# Altium schematic sheet P1.schdoc
size 420 x 297 mm; Symbol: Drawing-Symbol_A3; @Create Time: 23:14:21; @Update Time: 22:26:34; Border: 1; Width: 1655; Height: 1170; Region Start: 1; X Region Count: 6; Y Region Count: 4; Blade Width: 10; Title Block Position: 3; @Board Name: Board1; Drawed: YongjianZhu; Version: V2.0; Page Size: A3; @Project Name: AWUG20250915_backup; @Page Count: 1; @Update Date: 2025-09-18; @Create Date: 2025-09-17; @Schematic Name: Schematic1; @Page No: 1; @Page Name: P1; Device: Drawing-Symbol_A3
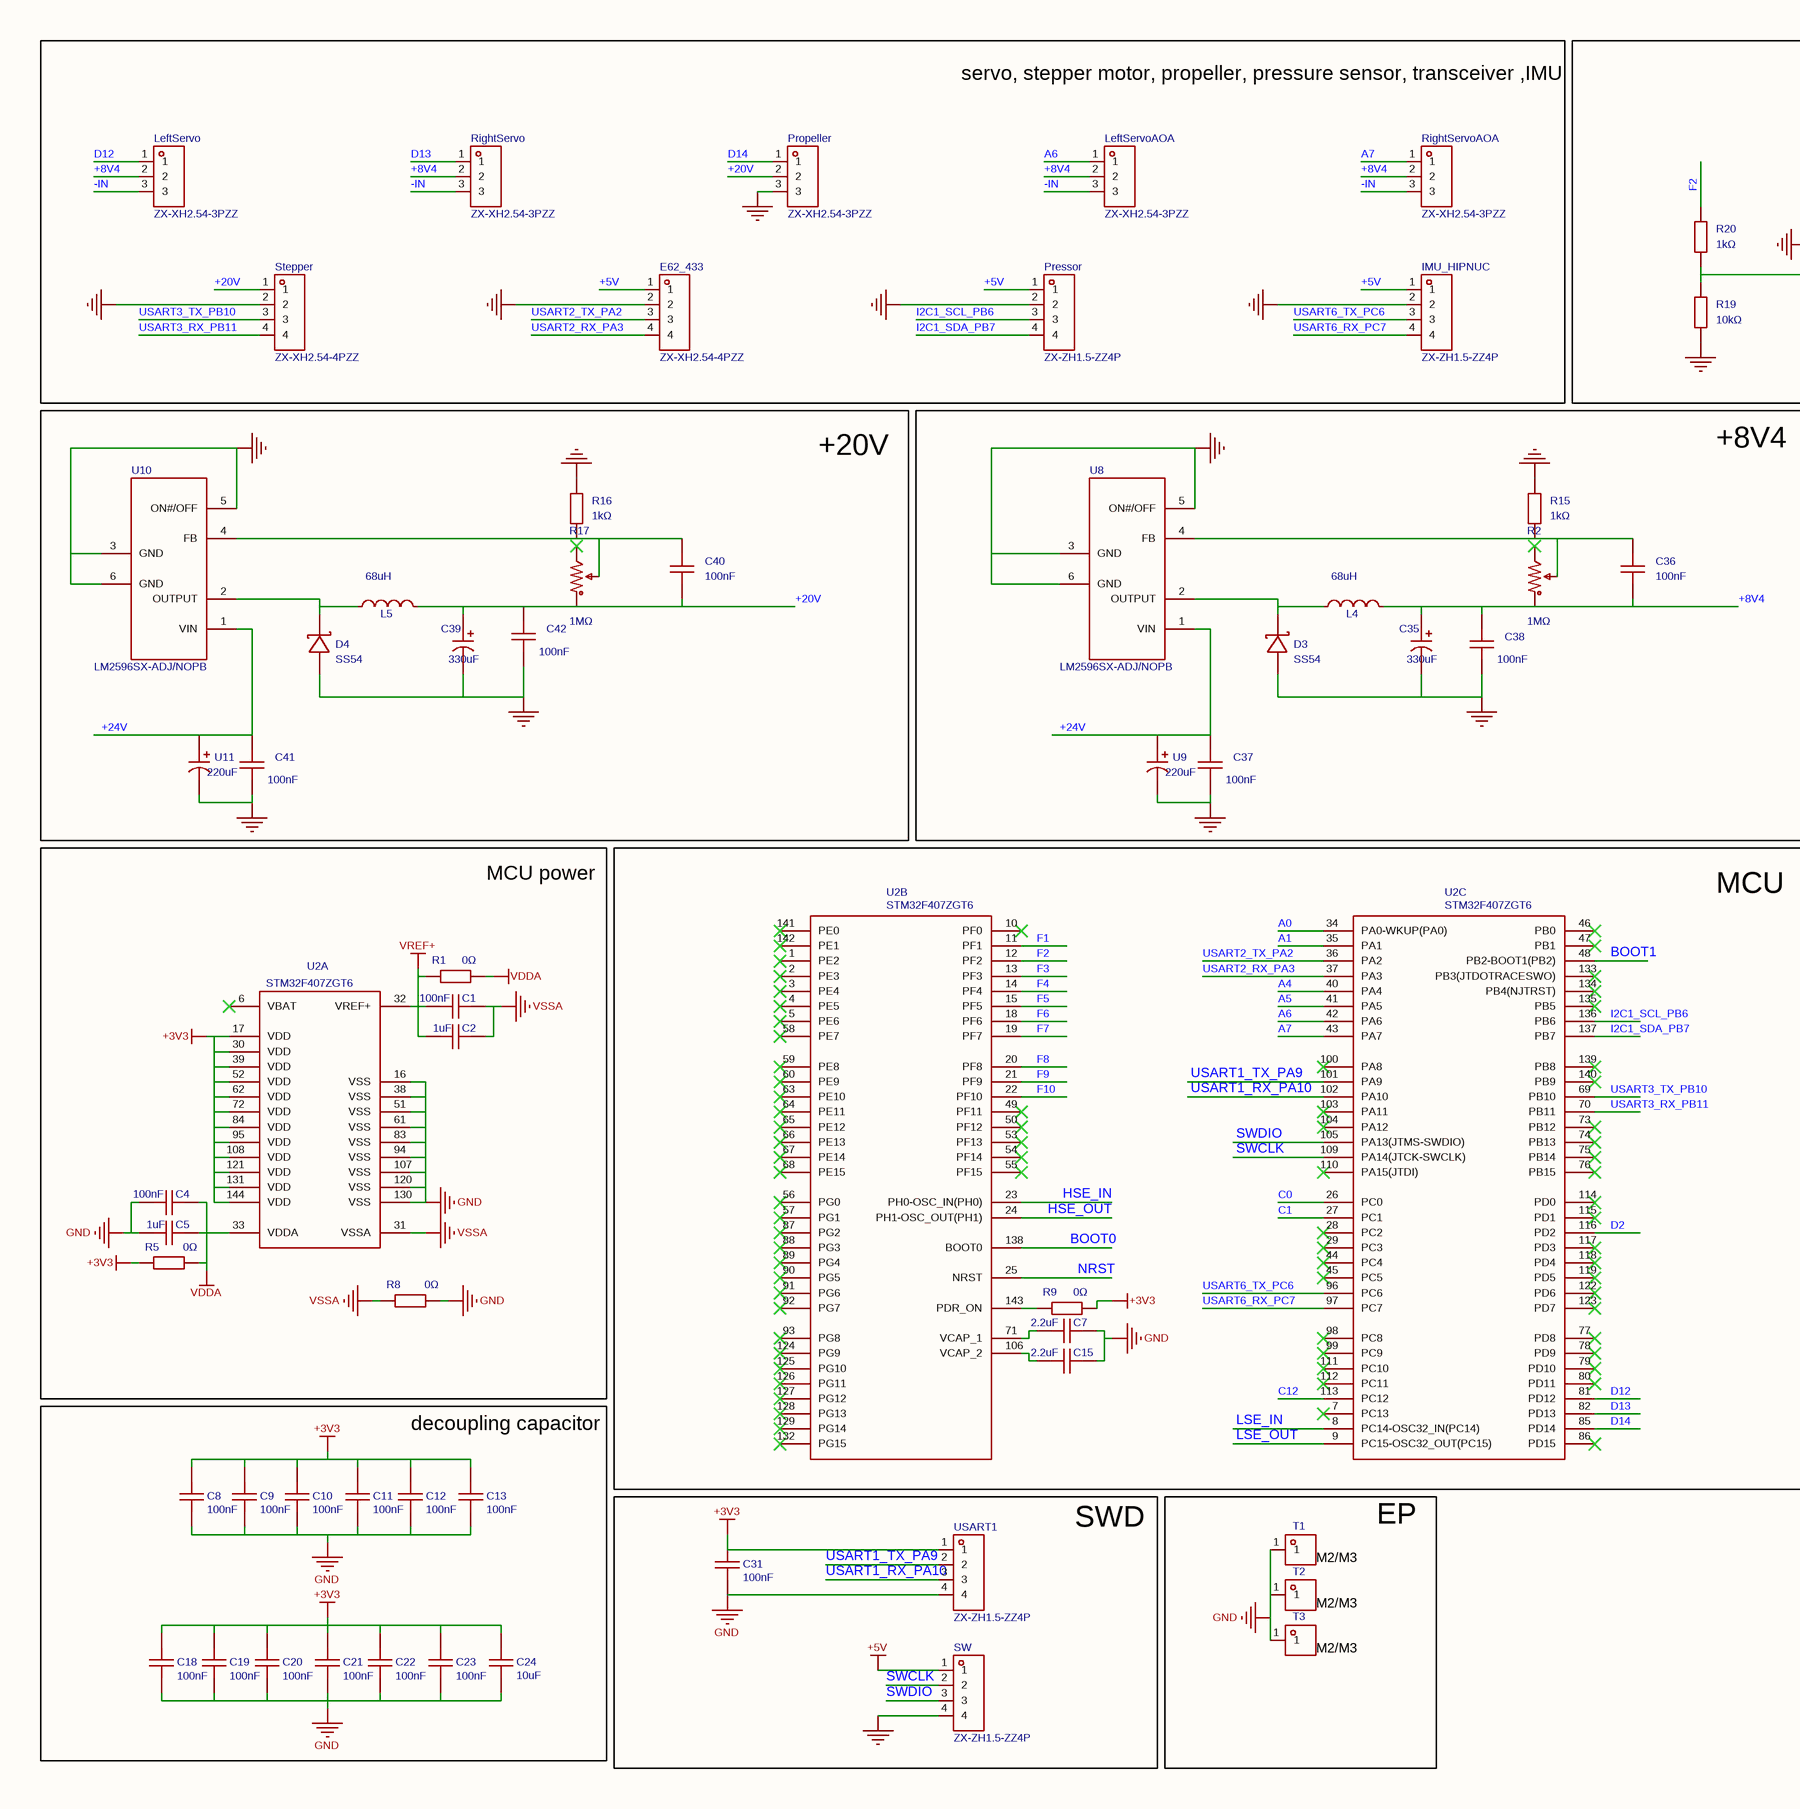
[diagram p0: P1.schdoc, left]
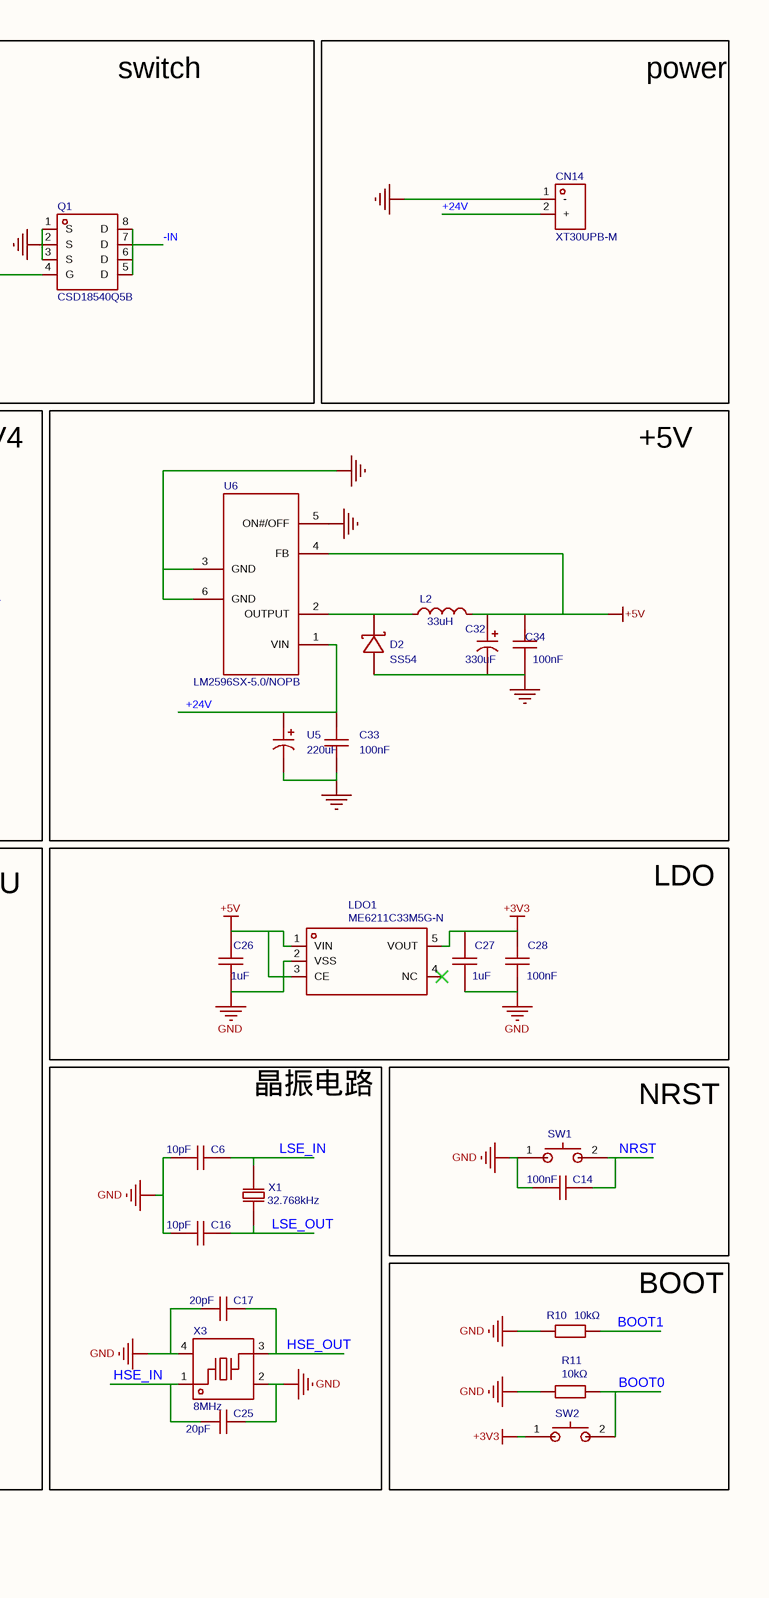
[diagram p1: P1.schdoc, right]

## Parts
C1  100nF  [C0603]
C2  1uF  [C0603]
C4  100nF  [C0603]
C5  1uF  [C0603]
C6  10pF  [C0603]
C7  2.2uF  [C0603]
C8  100nF  [C0603]
C9  100nF  [C0603]
C10  100nF  [C0603]
C11  100nF  [C0603]
C12  100nF  [C0603]
C13  100nF  [C0603]
C14  100nF  [C0603]
C15  2.2uF  [C0603]
C16  10pF  [C0603]
C17  20pF  [C0603]
C18  100nF  [C0603]
C19  100nF  [C0603]
C20  100nF  [C0603]
C21  100nF  [C0603]
C22  100nF  [C0603]
C23  100nF  [C0603]
C24  10uF  [C0603]
C25  20pF  [C0603]
C26  1uF  [C0603]
C27  1uF  [C0603]
C28  100nF  [C0603]
C31  100nF  [C0603]
C32  330uF  [CAP-SMD_BD10.0-L10.3-W10.3-LS10.8-FD]
C33  100nF  [C0805]
C34  100nF  [C0805]
C35  330uF  [CAP-SMD_BD10.0-L10.3-W10.3-LS10.8-FD]
C36  100nF  [C0805]
C37  100nF  [C0805]
C38  100nF  [C0805]
C39  330uF  [CAP-SMD_BD10.0-L10.3-W10.3-LS10.8-FD]
C40  100nF  [C0805]
C41  100nF  [C0805]
C42  100nF  [C0805]
CN14  XT30UPB-M  [CONN-TH_XT30UPB-M]
D2  SS54  [SMA_L4.4-W2.8-LS5.4-R-RD]
D3  SS54  [SMA_L4.4-W2.8-LS5.4-R-RD]
D4  SS54  [SMA_L4.4-W2.8-LS5.4-R-RD]
E62_433  ZX-XH2.54-4PZZ  [CONN-TH_4P-P2.50_4PIN]
IMU_HIPNUC  ZX-ZH1.5-ZZ4P  [CONN-TH_4P-P1.50_ZX-ZH1.5-ZZ4P]
L2  33uH  [IND-SMD_L11.6-W10.1]
L4  68uH  [IND-SMD_L13.5-W12.6_XR_XR1265]
L5  68uH  [IND-SMD_L13.5-W12.6_XR_XR1265]
LDO1  ME6211C33M5G-N  [SOT-23-5_L3.0-W1.7-P0.95-LS2.8-BL]
LeftServo  ZX-XH2.54-3PZZ  [CONN-TH_3P-P2.54_2501S-3P]
LeftServoAOA  ZX-XH2.54-3PZZ  [CONN-TH_3P-P2.54_2501S-3P]
Pressor  ZX-ZH1.5-ZZ4P  [CONN-TH_4P-P1.50_ZX-ZH1.5-ZZ4P]
Propeller  ZX-XH2.54-3PZZ  [CONN-TH_3P-P2.54_2501S-3P]
Q1  CSD18540Q5B  [VSON-CLIP-8_L5.0-W6.0-P1.27-BL]
R1  0Ω  [R0603]
R2  1MΩ  [RES-ADJ-TH_3P-L10.0-W10.0-P2.50-BL-BS]
R5  0Ω  [R0603]
R8  0Ω  [R0603]
R9  0Ω  [R0603]
R10  10kΩ  [R0603]
R11  10kΩ  [R0603]
R15  1kΩ  [R0805]
R16  1kΩ  [R0805]
R17  1MΩ  [RES-ADJ-TH_3P-L10.0-W10.0-P2.50-BL-BS]
R19  10kΩ  [R0603]
R20  1kΩ  [R0805]
RightServo  ZX-XH2.54-3PZZ  [CONN-TH_3P-P2.54_2501S-3P]
RightServoAOA  ZX-XH2.54-3PZZ  [CONN-TH_3P-P2.54_2501S-3P]
Stepper  ZX-XH2.54-4PZZ  [CONN-TH_4P-P2.50_4PIN]
SW  ZX-ZH1.5-ZZ4P  [CONN-TH_4P-P1.50_ZX-ZH1.5-ZZ4P]
SW1  GT-TC029B-H020-L1N  [SW-SMD_L3.9-W2.9-P4.15-LS5.0]  (value not drawn)
SW2  GT-TC029B-H020-L1N  [SW-SMD_L3.9-W2.9-P4.15-LS5.0]  (value not drawn)
T1  M2_M3  [M3X16+6_L]  (value not drawn)
T2  M2_M3  [M3X16+6_L]  (value not drawn)
T3  M2_M3  [M3X16+6_L]  (value not drawn)
U2  STM32F407ZGT6  [LQFP-144_L20.0-W20.0-P0.50-LS22.0-BL]  (parts A,B,C of 3)
U5  220uF  [CAP-SMD_BD10.0-L10.3-W10.3-FD]
U6  LM2596SX-5.0/NOPB  [TO-263-5_L10.2-W8.9-P1.70-TL]
U8  LM2596SX-ADJ/NOPB  [TO-263-5_L10.2-W8.9-P1.70-TL]
U9  220uF  [CAP-SMD_BD10.0-L10.3-W10.3-FD]
U10  LM2596SX-ADJ/NOPB  [TO-263-5_L10.2-W8.9-P1.70-TL]
U11  220uF  [CAP-SMD_BD10.0-L10.3-W10.3-FD]
USART1  ZX-ZH1.5-ZZ4P  [CONN-TH_4P-P1.50_ZX-ZH1.5-ZZ4P]
X1  32.768kHz  [FC-135R_L3.2-W1.5]
X3  8MHz  [CRYSTAL-SMD_4P-L3.2-W2.5-BL]

## Blocks framed on the sheet
switch: Q1 R19 R20
power: CN14
+20V: C39-C42 D4 L5 R16 R17 U10 U11
+8V4: C35-C38 D3 L4 R2 R15 U8 U9
+5V: C32-C34 D2 L2 U5 U6
MCU power: C1 C2 C4 C5 R1 R5 R8 U2
MCU: C7 C15 R9 U2
LDO: C26-C28 LDO1
晶振电路: C6 C16 C17 C25 X1 X3
NRST: C14 SW1
BOOT: R10 R11 SW2
decoupling capacitor: C8-C13 C18-C24
SWD: C31 SW USART1
EP: T1-T3

## Nets
+3V3: C8.2 C9.2 C10.2 C11.2 C12.2 C13.2 C18.2 C19.2 C20.2 C21.2 C22.2 C23.2 C24.2 C27.2 C28.2 C31.2 LDO1.5(VOUT) R5.2 R9.2 SW2.1 U2.17(VDD) U2.30(VDD) U2.39(VDD) U2.52(VDD) U2.62(VDD) U2.72(VDD) U2.84(VDD) U2.95(VDD) U2.108(VDD) U2.121(VDD) U2.131(VDD) U2.144(VDD) USART1.1
+5V: C26.2 C32.1 C34.2 E62_433.1 IMU_HIPNUC.1 L2.2 LDO1.1(VIN) LDO1.3(CE) Pressor.1 SW.1 U6.4(FB)
GND: C4.2 C5.2 C6.2 C7.2 C8.1 C9.1 C10.1 C11.1 C12.1 C13.1 C14.2 C15.2 C16.2 C17.1 C18.1 C19.1 C20.1 C21.1 C22.1 C23.1 C24.1 C25.2 C26.1 C27.1 C28.1 C31.1 C32.2 C33.1 C34.1 C35.2 C37.1 C38.1 C39.2 C41.1 C42.1 CN14.1(-) D2.1(A) D3.1(A) D4.1(A) E62_433.2 IMU_HIPNUC.2 LDO1.2(VSS) Pressor.2 Propeller.3 Q1.1(S) Q1.2(S) Q1.3(S) R8.1 R10.1 R11.1 R15.2 R16.2 R19.1 Stepper.2 SW.4 SW1.1 T1.1 T2.1 T3.1 U2.16(VSS) U2.38(VSS) U2.51(VSS) U2.61(VSS) U2.83(VSS) U2.94(VSS) U2.107(VSS) U2.120(VSS) U2.130(VSS) U5.2 U6.3(GND) U6.5(ON#/OFF) U6.6(GND) U8.3(GND) U8.5(ON#/OFF) U8.6(GND) U9.2 U10.3(GND) U10.5(ON#/OFF) U10.6(GND) U11.2 USART1.4 X3.2(GND) X3.4(GND)
VDDA: C4.1 C5.1 R1.2 R5.1 U2.33(VDDA)
VREF+: C1.2 C2.2 R1.1 U2.32(VREF+)
VSSA: C1.1 C2.1 R8.2 U2.31(VSSA)
+8V4: C35.1 C36.1 C38.2 L4.2 LeftServo.2 LeftServoAOA.2 R2.1 RightServo.2 RightServoAOA.2
+20V: C39.1 C40.1 C42.2 L5.2 Propeller.2 R17.1 Stepper.1
+24V: C33.2 C37.2 C41.2 CN14.2(+) U5.1 U6.1(VIN) U8.1(VIN) U9.1 U10.1(VIN) U11.1
-IN: LeftServo.3 LeftServoAOA.3 Q1.5(D) Q1.6(D) Q1.7(D) Q1.8(D) RightServo.3 RightServoAOA.3
A0: U2.34(PA0-WKUP(PA0))
A1: U2.35(PA1)
A4: U2.40(PA4)
A5: U2.41(PA5)
A6: LeftServoAOA.1 U2.42(PA6)
A7: RightServoAOA.1 U2.43(PA7)
BOOT0: R11.2 SW2.2 U2.138(BOOT0)
BOOT1: R10.2 U2.48(PB2-BOOT1(PB2))
C0: U2.26(PC0)
C1: U2.27(PC1)
C12: U2.113(PC12)
D2: U2.116(PD2)
D12: LeftServo.1 U2.81(PD12)
D13: RightServo.1 U2.82(PD13)
D14: Propeller.1 U2.85(PD14)
F1: U2.11(PF1)
F2: R20.2 U2.12(PF2)
F3: U2.13(PF3)
F4: U2.14(PF4)
F5: U2.15(PF5)
F6: U2.18(PF6)
F7: U2.19(PF7)
F8: U2.20(PF8)
F9: U2.21(PF9)
F10: U2.22(PF10)
HSE_IN: C25.1 U2.23(PH0-OSC_IN(PH0)) X3.1
HSE_OUT: C17.2 U2.24(PH1-OSC_OUT(PH1)) X3.3
I2C1_SCL_PB6: Pressor.3 U2.136(PB6)
I2C1_SDA_PB7: Pressor.4 U2.137(PB7)
LSE_IN: C6.1 U2.8(PC14-OSC32_IN(PC14)) X1.1
LSE_OUT: C16.1 U2.9(PC15-OSC32_OUT(PC15)) X1.2
NRST: C14.1 SW1.2 U2.25(NRST)
SWCLK: SW.2 U2.109(PA14(JTCK-SWCLK))
SWDIO: SW.3 U2.105(PA13(JTMS-SWDIO))
USART1_RX_PA10: U2.102(PA10) USART1.3
USART1_TX_PA9: U2.101(PA9) USART1.2
USART2_RX_PA3: E62_433.4 U2.37(PA3)
USART2_TX_PA2: E62_433.3 U2.36(PA2)
USART3_RX_PB11: Stepper.4 U2.70(PB11)
USART3_TX_PB10: Stepper.3 U2.69(PB10)
USART6_RX_PC7: IMU_HIPNUC.4 U2.97(PC7)
USART6_TX_PC6: IMU_HIPNUC.3 U2.96(PC6)
NetC7_1: C7.1 U2.71(VCAP_1)
NetC15_1: C15.1 U2.106(VCAP_2)
NetC36_2: C36.2 R2.2 R15.1 U8.4(FB)
NetC40_2: C40.2 R16.1 R17.2 U10.4(FB)
NetD2_2: D2.2(K) L2.1 U6.2(OUTPUT)
NetD3_2: D3.2(K) L4.1 U8.2(OUTPUT)
NetD4_2: D4.2(K) L5.1 U10.2(OUTPUT)
NetQ1_4: Q1.4(G) R19.2 R20.1
NetR9_1: R9.1 U2.143(PDR_ON)

Not connected (* = marked no-connect by the designer): LDO1 4(NC)*; R2 3*; R17 3*; U2 1(PE2)* 2(PE3)* 3(PE4)* 4(PE5)* 5(PE6)* 6(VBAT)* 7(PC13)* 10(PF0)* 28(PC2)* 29(PC3)* 44(PC4)* 45(PC5)* 46(PB0)* 47(PB1)* 49(PF11)* 50(PF12)* 53(PF13)* 54(PF14)* 55(PF15)* 56(PG0)* 57(PG1)* 58(PE7)* 59(PE8)* 60(PE9)* 63(PE10)* 64(PE11)* 65(PE12)* 66(PE13)* 67(PE14)* 68(PE15)* 73(PB12)* 74(PB13)* 75(PB14)* 76(PB15)* 77(PD8)* 78(PD9)* 79(PD10)* 80(PD11)* 86(PD15)* 87(PG2)* 88(PG3)* 89(PG4)* 90(PG5)* 91(PG6)* 92(PG7)* 93(PG8)* 98(PC8)* 99(PC9)* 100(PA8)* 103(PA11)* 104(PA12)* 110(PA15(JTDI))* 111(PC10)* 112(PC11)* 114(PD0)* 115(PD1)* 117(PD3)* 118(PD4)* 119(PD5)* 122(PD6)* 123(PD7)* 124(PG9)* 125(PG10)* 126(PG11)* 127(PG12)* 128(PG13)* 129(PG14)* 132(PG15)* 133(PB3(JTDOTRACESWO))* 134(PB4(NJTRST))* 135(PB5)* 139(PB8)* 140(PB9)* 141(PE0)* 142(PE1)*

## Notes on the sheet
- servo, stepper motor, propeller, pressure sensor, transceiver ,IMU
- 创建日期
- 2025-09-17
- 原理图
- 板子
- Schematic1
- Board1
- 更新日期
- 图页
- 2025-09-18
- P1
- 绘制
- 审阅
- YongjianZhu
- AWUG20250915_backup
- 版本
- V2.0
- 尺寸
- A3
- 页    1    共    1
- (in symbol M2_M3) M2/M3

## Library data of the parts
C1 C4 C8-C14 C18-C23 C28 C31 = CL10B104KB8NNNC: 容值:100nF;精度:±10%;额定电压:50V;材质(温度系数):X7R;; Manufacturer: SAMSUNG(三星); Symbol: 0.1u; AddInBom: yes; ModelId: ac125912035d415993ca9572d50418b1; ModelName: C0603_L1.6-W0.8-H0.8; ModelTransform: 62.992,31.496,0,0,0,0,0,0,0; Tolerance: ±10%; Voltage Rated: 50V; Temperature Coefficient: X7R; Device: CL10B104KB8NNNC; LCSC Part Name: 100nF ±10% 50V; SupplierPart: C1591; ManufacturerPart: CL10B104KB8NNNC; Supplier Footprint: 0603; JLCPCB Part Class: Extended Part; Datasheet: https://atta.szlcsc.com/upload/public/pdf/source/20160218/1457707763339.pdf; Supplier: LCSC; ConvertToPcb: yes; FootprintName: C0603; Value: 100nF
C2 C5 C26 C27 = CL10A105KB8NNNC: 容值:1uF;精度:±10%;额定电压:50V;材质(温度系数):X5R;; Manufacturer: SAMSUNG(三星); Symbol: 1u; AddInBom: yes; ModelId: ac125912035d415993ca9572d50418b1; ModelName: C0603_L1.6-W0.8-H0.8; ModelTransform: 62.992,31.496,0,0,0,0,0,0,0; Tolerance: ±10%; Voltage Rated: 50V; Temperature Coefficient: X5R; Device: CL10A105KB8NNNC; LCSC Part Name: 1uF ±10% 50V; SupplierPart: C15849; ManufacturerPart: CL10A105KB8NNNC; Supplier Footprint: 0603; JLCPCB Part Class: Basic Part; Datasheet: https://atta.szlcsc.com/upload/public/pdf/source/20160218/1457707763339.pdf; Supplier: LCSC; ConvertToPcb: yes; FootprintName: C0603; Value: 1uF
C6 C16 = CL10C100JB8NNNC: 容值:10pF;精度:±5%;额定电压:50V;材质(温度系数):C0G;; Manufacturer: SAMSUNG(三星); Symbol: 10p; AddInBom: yes; ModelId: ac125912035d415993ca9572d50418b1; ModelName: C0603_L1.6-W0.8-H0.8; ModelTransform: 62.992,31.496,0,0,0,0,0,0,0; Tolerance: ±5%; Voltage Rated: 50V; Temperature Coefficient: C0G; Device: CL10C100JB8NNNC; LCSC Part Name: 10pF ±5% 50V; SupplierPart: C1634; ManufacturerPart: CL10C100JB8NNNC; Supplier Footprint: 0603; JLCPCB Part Class: Basic Part; Datasheet: https://atta.szlcsc.com/upload/public/pdf/source/20160218/1457707763339.pdf; Supplier: LCSC; ConvertToPcb: yes; FootprintName: C0603; Value: 10pF
C7 C15 = CL10A225KO8NNNC: 容值:2.2uF;精度:±10%;额定电压:16V;材质(温度系数):X5R;; Manufacturer: SAMSUNG(三星); Symbol: 2.2u; AddInBom: yes; ModelId: ac125912035d415993ca9572d50418b1; ModelName: C0603_L1.6-W0.8-H0.8; ModelTransform: 62.992,31.496,0,0,0,0,0,0,0; Tolerance: ±10%; Voltage Rated: 16V; Temperature Coefficient: X5R; Device: CL10A225KO8NNNC; LCSC Part Name: 2.2uF ±10% 16V; SupplierPart: C23630; ManufacturerPart: CL10A225KO8NNNC; Supplier Footprint: 0603; JLCPCB Part Class: Basic Part; Datasheet: https://atta.szlcsc.com/upload/public/pdf/source/20160218/1457707763339.pdf; Supplier: LCSC; ConvertToPcb: yes; FootprintName: C0603; Value: 2.2uF
C17 C25 = CL10C200JB8NNNC: 容值:20pF;精度:±5%;额定电压:50V;材质(温度系数):C0G;; Manufacturer: SAMSUNG(三星); AddInBom: yes; ModelId: ac125912035d415993ca9572d50418b1; ModelName: C0603_L1.6-W0.8-H0.8; ModelTransform: 62.992,31.496,0,0,0,0,0,0,0; Tolerance: ±5%; Voltage Rated: 50V; Temperature Coefficient: C0G; Device: CL10C200JB8NNNC; Symbol: CL10C200JB8NNNC; LCSC Part Name: 20pF ±5% 50V; SupplierPart: C1648; ManufacturerPart: CL10C200JB8NNNC; Supplier Footprint: 0603; JLCPCB Part Class: Basic Part; Datasheet: https://atta.szlcsc.com/upload/public/pdf/source/20160218/1457707763339.pdf; Supplier: LCSC; ConvertToPcb: yes; FootprintName: C0603; Value: 20pF
C24 = CL10A106MA8NRNC: 容值:10uF;精度:±20%;额定电压:25V;材质(温度系数):X5R;; Manufacturer: SAMSUNG(三星); Symbol: 10u; AddInBom: yes; ModelId: ac125912035d415993ca9572d50418b1; ModelName: C0603_L1.6-W0.8-H0.8; ModelTransform: 62.992,31.496,0,0,0,0,0,0,0; Tolerance: ±20%; Voltage Rated: 25V; Temperature Coefficient: X5R; Device: CL10A106MA8NRNC; LCSC Part Name: 10uF ±20% 25V; SupplierPart: C96446; ManufacturerPart: CL10A106MA8NRNC; Supplier Footprint: 0603; JLCPCB Part Class: Basic Part; Datasheet: https://atta.szlcsc.com/upload/public/pdf/source/20160218/1457707763339.pdf; Supplier: LCSC; ConvertToPcb: yes; FootprintName: C0603; Value: 10uF
C32 C35 C39 = LZ330UF35V90RV0141: 容值:330uF;精度:±20%;额定电压:35V;纹波电流:670mA@120Hz;等效串联电阻(ESR):-;; Manufacturer: KNSCHA(科尼盛); AddInBom: yes; ModelId: 8e001d7f59ed47679340839965790bfc; ModelTransform: 425.196,405.511,0,180,0,0,0,0,0; Tolerance: ±20%; Voltage Rating: 35V; Lifetime: 2000hrs@105℃; Symbol: LZ330UF35V90RV0141; Device: LZ330UF35V90RV0141; LCSC Part Name: 330uF ±20% 35V; SupplierPart: C5155335; ManufacturerPart: LZ330UF35V90RV0141; Supplier Footprint: SMD,D10xL10.5mm; JLCPCB Part Class: 扩展库; Datasheet: https://atta.szlcsc.com/upload/public/pdf/source/20220901/F5A20E9703C915D0FCA0A76B4747321B.pdf; Supplier: LCSC; ConvertToPcb: yes; FootprintName: CAP-SMD_BD10.0-L10.3-W10.3-LS10.8-FD; ModelName: CAP-SMD_BD10.0-L10.3-W10.3-LS10.8-FD; Value: 330uF; Ripple Current: 670mA@120Hz; Equivalent Series Resistance(ESR): -; Diameter: 10mm; Height - Seated (Max): 10.5mm; Operating Temperature: -55℃~+105℃
C33 C34 C36-C38 C40-C42 = CC0805KRX7R9BB104: 容值:100nF;精度:±10%;额定电压:50V;材质(温度系数):X7R;; Manufacturer: YAGEO(国巨); AddInBom: yes; ModelId: 1ba041120af144c991958decab20d241; ModelName: C0805_L2.0-W1.3-H1.3; ModelTransform: 78.74,51.181,0,0,0,0,0,0.0005,0; Tolerance: ±10%; Voltage Rated: 50V; Temperature Coefficient: X7R; Symbol: CC0805KRX7R9BB104; Device: CC0805KRX7R9BB104; LCSC Part Name: 100nF ±10% 50V; SupplierPart: C49678; ManufacturerPart: CC0805KRX7R9BB104; Supplier Footprint: 0805; JLCPCB Part Class: 基础库; Datasheet: https://atta.szlcsc.com/upload/public/pdf/source/20180224/C181747_15194369449651363981.pdf; Supplier: LCSC; ConvertToPcb: yes; FootprintName: C0805; Value: 100nF
CN14 = XT30UPB-M: 类别:-;类型1:-;; Manufacturer: AMASS(艾迈斯); AddInBom: yes; ModelId: ffe3e48218434a4693f4f4701a4fe37e; ModelTransform: 401.574,204.724,0,0,0,0,0,0,-78.74; RatedVoltage: DC 500V; InterfaceType: 公头; MetalMaterial: 镀金; InsulationMaterial: PA; RatedCurrent: 15A; contact resistance: 0.65mΩ; Symbol: XT30UPB-M; Device: XT30UPB-M; LCSC Part Name: AMASS(艾迈斯)板载立式 航模锂电池控制器连接器插头 公头XT30UPB-M; SupplierPart: C428721; ManufacturerPart: XT30UPB-M; Supplier Footprint: -; JLCPCB Part Class: 扩展库; Datasheet: https://atta.szlcsc.com/upload/public/pdf/source/20230412/7B5DFEF57C9EA5273853390C734B3AC5.pdf; Supplier: LCSC; ConvertToPcb: yes; FootprintName: CONN-TH_XT30UPB-M; ModelName: CONN-TH_XT30UPB-M; Power: -; Output: -; Input: -; Size: -; Interface: -; Type: 航模插头; Colour: 黄色; MaximumCurrent: -; Type1: -; NumberOfUSBHoles: -; RecommendedWireGauge: -; FlameRetardantGrade: -; Belt length: -; specifications: -
D2-D4 = SS54_C22452: 二极管配置:独立式;正向压降(Vf):550mV@5A;直流反向耐压(Vr):40V;整流电流:5A;; Manufacturer: MDD(辰达半导体); AddInBom: yes; ModelId: 228de99b63224bd3982b21290755dd84; ModelTransform: 204.724,110.236,0,0,0,0,0,0,0; Diode Configuration: 独立式; Reverse Voltage (Vr): 40V; Rectified Current: 5A; Reverse Leakage Current (Ir): 1mA@40V; Symbol: SS54_C22452; Device: SS54_C22452; LCSC Part Name: 电压:40V 电流:5A; SupplierPart: C22452; ManufacturerPart: SS54; Supplier Footprint: SMA(DO-214AC); JLCPCB Part Class: 基础库; Datasheet: https://atta.szlcsc.com/upload/public/pdf/source/20240710/73DFBB65C1883B895E62D589679033DF.pdf; Supplier: LCSC; ConvertToPcb: yes; FootprintName: SMA_L4.4-W2.8-LS5.4-R-RD; ModelName: SMA_L4.4-W2.8-LS5.4-R-RD; Forward Voltage (Vf@If): 550mV@5A
E62_433 Stepper = ZX-XH2.54-4PZZ: 插针结构:1x4P;间距:2.5mm;安装方式:直插;参考系列:XH;总PIN数:4P;排数:1;每排PIN数:4;行距:-;额定电流:3A;触头材质:黄铜;触头镀层:锡;工作温度:-25℃~+85℃;; Manufacturer: Megastar(兆星); AddInBom: yes; ModelId: 5458b55d28744a3c82c1e0e5bffe4e87; ModelTransform: 492.125,224.409,0,180,0,0,0,17.717,-118.11; Pins Structure: 1x4P; Pitch: 2.5mm; Reference Series: XH; Number of PINs Per Row: 4; Current Rating: 3A; Voltage Rating: 250V; Plastic Material: PA66; Flame Retardant Rating: UL94V-0; Z-Height of the Board: 7mm; X-Length of Bottom Edge on Board (Spacing Line): 12.5mm; Y-Width of Bottom Edge on Board: 5.9mm; Symbol: ZX-XH2.54-4PZZ; Device: ZX-XH2.54-4PZZ; LCSC Part Name: 1x4P 间距:2.5mm 直插 系列:XH; SupplierPart: C7429634; ManufacturerPart: ZX-XH2.54-4PZZ; Supplier Footprint: 插件,P=2.5mm; JLCPCB Part Class: 扩展库; Datasheet: https://atta.szlcsc.com/upload/public/pdf/source/20230619/B529A2163E0159A644AB3383D208FB03.pdf; Supplier: LCSC; ConvertToPcb: yes; FootprintName: CONN-TH_4P-P2.50_4PIN; ModelName: CONN-TH_4P-P2.50_4PIN; Mounting Type: 直插; Number of Pins: 4P; Number of Rows: 1; Row Spacing: -; Contact Material: 黄铜; Contact Plating: 锡; Operating Temperature: -25℃~+85℃; Supplementary Features: -; Color: 白色
IMU_HIPNUC Pressor SW USART1 = ZX-ZH1.5-ZZ4P: 插针结构:1x4P;间距:1.5mm;安装方式:直插;参考系列:ZH;总PIN数:4P;排数:1;每排PIN数:4;行距:-;额定电流:-;触头材质:黄铜;触头镀层:-;工作温度:-25℃~+85℃;; Manufacturer: Megastar(兆星); AddInBom: yes; ModelId: f45c199c47f741fca50cd4b561e46815; ModelTransform: 295.669,145.669,0,0,0,0,0,15.748,-98.425; Pins Structure: 1x4P; Pitch: 1.5mm; Reference Series: ZH; Number of PINs Per Row: 4; Voltage Rating: 250V; Plastic Material: PA66; Flame Retardant Rating: UL94V-0; Z-Height of the Board: 4.55mm; X-Length of Bottom Edge on Board (Spacing Line): 7.5mm; Y-Width of Bottom Edge on Board: 3.7mm; Symbol: ZX-ZH1.5-ZZ4P; Device: ZX-ZH1.5-ZZ4P; LCSC Part Name: 1x4P 间距:1.5mm 直插 系列:ZH; SupplierPart: C7429526; ManufacturerPart: ZX-ZH1.5-ZZ4P; Supplier Footprint: 插件,P=1.5mm; Datasheet: https://item.szlcsc.com/datasheet/ZX-ZH1.5-ZZ4P/8427443.html; Supplier: LCSC; ConvertToPcb: yes; FootprintName: CONN-TH_4P-P1.50_ZX-ZH1.5-ZZ4P; ModelName: CONN-TH_4P-P1.50_ZX-ZH1.5-ZZ4P; Mounting Type: 直插; Number of Pins: 4P; Number of Rows: 1; Row Spacing: -; Current Rating: -; Contact Material: 黄铜; Contact Plating: -; Operating Temperature: -25℃~+85℃; Supplementary Features: -; Color: 白色
L2 = CYA1040-33UH: 电感值:33uH;精度:±20%;额定电流:4A;饱和电流(Isat):4.5A;直流电阻(DCR):85mΩ;; Manufacturer: SHOU HAN(首韩); AddInBom: yes; ModelId: ac12291101034cb3933812538e57e62f; ModelName: IND-SMD_L11.6-W10.1-H4.0; ModelTransform: 456.692,397.67637,0,0,0,0,0,0,0; Tolerance: ±20%; Rated Current: 4A; Saturation Current (Isat): 4.5A; DC Resistance (DCR): 85mΩ; Symbol: CYA1040-33UH; Device: CYA1040-33UH; LCSC Part Name: 33uH ±20% 4.5A; SupplierPart: C6364680; ManufacturerPart: CYA1040-33UH; Supplier Footprint: SMD,11.6x10.1mm; JLCPCB Part Class: 扩展库; Datasheet: https://atta.szlcsc.com/upload/public/pdf/source/20230523/B70F7065494BF81774AD17851D575223.pdf; Supplier: LCSC; ConvertToPcb: yes; FootprintName: IND-SMD_L11.6-W10.1; Value: 33uH
L4 L5 = XR1265-680M: 电感值:68uH;精度:±20%;额定电流:4A;饱和电流(Isat):4.5A;类型:一体成型电感;; Manufacturer: XR(祥如); AddInBom: yes; ModelId: 679001ae4d6c4fe286c0709c57e5d1bc; ModelTransform: 532.2824,496.062,0,0,0,0,0,0,0; Tolerance: ±20%; Current Rating: 4A; Current - Saturation(Isat): 4.5A; DC Resistance(DCR): 140mΩ; Type: 一体成型电感; Symbol: XR1265-680M; Device: XR1265-680M; LCSC Part Name: 68uH ±20% 4.5A; SupplierPart: C5339474; ManufacturerPart: XR1265-680M; Supplier Footprint: SMD,13.5x12.6mm; JLCPCB Part Class: 扩展库; Datasheet: https://atta.szlcsc.com/upload/public/pdf/source/20240328/CD27214B42F6135A726742CAD8144B94.pdf; Supplier: LCSC; ConvertToPcb: yes; FootprintName: IND-SMD_L13.5-W12.6_XR_XR1265; ModelName: IND-SMD_L13.5-W12.6_XR_XR1265; Value: 68uH
LDO1 = ME6211C33M5G-N: 输出类型:固定;工作电压:6V;输出电压:3.3V;输出电流:500mA;电源纹波抑制比(PSRR):70dB@(1kHz);输出极性:正极;; Manufacturer: MICRONE(南京微盟); AddInBom: yes; ModelId: 0a2a1b8f50944f73965918ad6e5fe167; ModelName: SOT-23-5_L2.9-W1.6-H1.1-LS2.8-P0.95; ModelTransform: 118.60433,114.173,0,90,0,0,0.0005,0.0005,0; Output Type: 固定; Voltage - Supply: 6V; Output Voltage: 3.3V; Output Current: 500mA; Voltage Dropout: 120mV@(100mA); standby current: 60uA; Noise: 50uVrms; Output Configuration: 正极; Number of Outputs: 1; Device: ME6211C33M5G-N; Symbol: ME6211C33M5G-N; LCSC Part Name: 输入6V 输出3.3V 500mA; SupplierPart: C82942; ManufacturerPart: ME6211C33M5G-N; Supplier Footprint: SOT-23-5; JLCPCB Part Class: Extended Part; Datasheet: https://atta.szlcsc.com/upload/public/pdf/source/20170918/C82942_1505727073070976520.pdf; Supplier: LCSC; ConvertToPcb: yes; FootprintName: SOT-23-5_L3.0-W1.7-P0.95-LS2.8-BL; Power Supply Rejection Ratio (PSRR): 70dB@(1kHz); Features: 过流保护；带使能；短路保护; Operating Temperature: -40℃~+150℃
LeftServo LeftServoAOA Propeller RightServo RightServoAOA = ZX-XH2.54-3PZZ: 插针结构:1x3P;间距:2.5mm;安装方式:直插;参考系列:XH;总PIN数:3P;排数:1;每排PIN数:3;行距:-;额定电流:3A;触头材质:黄铜;触头镀层:锡;工作温度:-25℃~+85℃;; Manufacturer: Megastar(兆星); AddInBom: yes; ModelId: 59fb7dae5f784ea68cfa01be7f96d370; ModelTransform: 393.7,224.409,0,0,0,0,0,15.748,-137.795; Pins Structure: 1x3P; Pitch: 2.5mm; Reference Series: XH; Number of PINs Per Row: 3; Current Rating: 3A; Voltage Rating: 250V; Plastic Material: PA66; Flame Retardant Rating: UL94V-0; Z-Height of the Board: 7mm; X-Length of Bottom Edge on Board (Spacing Line): 10mm; Y-Width of Bottom Edge on Board: 5.9mm; Symbol: ZX-XH2.54-3PZZ; Device: ZX-XH2.54-3PZZ; LCSC Part Name: 1x3P 间距:2.5mm 直插 系列:XH; SupplierPart: C7429633; ManufacturerPart: ZX-XH2.54-3PZZ; Supplier Footprint: 插件,P=2.5mm; JLCPCB Part Class: 扩展库; Datasheet: https://item.szlcsc.com/datasheet/ZX-XH2.54-3PZZ/8427550.html; Supplier: LCSC; ConvertToPcb: yes; FootprintName: CONN-TH_3P-P2.54_2501S-3P; ModelName: CONN-TH_3P-P2.54_2501S-3P; Mounting Type: 直插; Number of Pins: 3P; Number of Rows: 1; Row Spacing: -; Contact Material: 黄铜; Contact Plating: 锡; Operating Temperature: -25℃~+85℃; Supplementary Features: -; Color: 白色
Q1 = CSD18540Q5B: 数量:1个N沟道;漏源电压(Vdss):60V;连续漏极电流(Id):100A;导通电阻(RDS(on)):2.6mΩ;耗散功率(Pd):3.8W;阈值电压(Vgs(th)):1.9V;; Manufacturer: TI(德州仪器); AddInBom: yes; ModelId: cf2f3117a71b44c9aa014f616d137869; ModelName: VSON-CLIP-8_L5.0-W6.0-H1.0-P1.27; ModelTransform: 236.22,196.981,0,90,0,0,0,0,0; Number: 1个N沟道; Drain to Source Voltage: 60V; Current - Continuous Drain(Id): 100A; RDS(on): 2.6mΩ; Pd - Power Dissipation: 3.8W; Gate Threshold Voltage (Vgs(th)): 1.9V; Gate Charge(Qg): 41nC@10V; Input Capacitance(Ciss): 4.23nF@30V; Reverse Transfer Capacitance (Crss@Vds): 20pF@30V; Symbol: CSD18540Q5B; Device: CSD18540Q5B; LCSC Part Name: 1个N沟道 耐压:60V; SupplierPart: C86513; ManufacturerPart: CSD18540Q5B; Supplier Footprint: VSON-8(5x6); JLCPCB Part Class: 扩展库; Datasheet: https://www.ti.com/lit/ds/symlink/csd18540q5b.pdf?ts=1718590350466&ref_url=https%253A%252F%252Fwww.ti.com.cn%252Fproduct%252Fzh-cn%252FCSD18540Q5B%253FkeyMatch%253DCSD18540Q5B%2526tisearch%253Dsearch-everything%2526usecase%253DOPN; Supplier: LCSC; ConvertToPcb: yes; FootprintName: VSON-CLIP-8_L5.0-W6.0-P1.27-BL; Operating Temperature: -55℃~+175℃; Configuration: -; Type: -; Output Capacitance(Coss): -
R1 R5 R8 R9 = 0603WAF0000T5E: 电阻类型:厚膜电阻;阻值:0Ω;精度:±1%;功率:100mW;工作电压:75V;; Manufacturer: UNI-ROYAL(厚声); AddInBom: yes; ModelId: fc143cca1e79419f9cd78b61e9279f08; ModelTransform: 31.8897,63.7794,0,90,0,0,0,0,0; Tolerance: ±1%; Power(Watts): 100mW; Voltage-Supply(Max): 75V; Device: 0603WAF0000T5E; Symbol: 0603WAF0000T5E; LCSC Part Name: 0Ω ±1% 100mW 厚膜电阻; SupplierPart: C21189; ManufacturerPart: 0603WAF0000T5E; Supplier Footprint: 0603; JLCPCB Part Class: Basic Part; Datasheet: https://item.szlcsc.com/datasheet/0603WAF0000T5E/21903.html; Supplier: LCSC; ConvertToPcb: yes; FootprintName: R0603; ModelName: R0603; Type: 厚膜电阻; Value: 0Ω; Operating Temperature: -55℃~+155℃
R2 R17 = 3296W-1-105: 阻值:1MΩ;精度:±10%;; Manufacturer: BOCHEN(博晨); Symbol: 3296W-1-105_C118944; AddInBom: yes; ModelId: b182808559bb43bda9e7de64b64134cb; ModelName: 3296W; ModelTransform: 374.015,188.976,0,90,0,0,0,0,-137.795; Tolerance: ±10%; Device: 3296W-1-105; LCSC Part Name: 1MΩ ±10%; SupplierPart: C118944; ManufacturerPart: 3296W-1-105; Supplier Footprint: 插件; JLCPCB Part Class: 扩展库; Datasheet: https://atta.szlcsc.com/upload/public/pdf/source/20171114/C118944_15106326625751117433.pdf; Supplier: LCSC; ConvertToPcb: yes; FootprintName: RES-ADJ-TH_3P-L10.0-W10.0-P2.50-BL-BS; Value: 1MΩ
R10 R11 R19 = 0603WAF1002T5E: 电阻类型:厚膜电阻;阻值:10kΩ;精度:±1%;功率:100mW;工作电压:75V;温度系数:±100ppm/℃;; Manufacturer: UNI-ROYAL(厚声); AddInBom: yes; ModelId: fc143cca1e79419f9cd78b61e9279f08; ModelTransform: 31.8897,63.7794,0,90,0,0,0,0,0; Tolerance: ±1%; Power(Watts): 100mW; Voltage-Supply(Max): 75V; Device: 0603WAF1002T5E; Symbol: 0603WAF1002T5E; LCSC Part Name: 厚膜电阻 10kΩ ±1% 100mW; SupplierPart: C25804; ManufacturerPart: 0603WAF1002T5E; Supplier Footprint: 0603; JLCPCB Part Class: Basic Part; Datasheet: https://atta.szlcsc.com/upload/public/pdf/source/20200306/C422600_1E6D84923E4A46A82E41ADD87F860B5C.pdf; Supplier: LCSC; ConvertToPcb: yes; FootprintName: R0603; ModelName: R0603; Type: 厚膜电阻; Value: 10kΩ; Temperature Coefficient: ±100ppm/℃; Operating Temperature: -55℃~+155℃
R15 R16 R20 = RT0805BRD071KL: 电阻类型:薄膜电阻;阻值:1kΩ;精度:±0.1%;功率:125mW;最大工作电压:150V;温度系数:±25ppm/℃;; Manufacturer: YAGEO(国巨); AddInBom: yes; ModelId: 37a81e68749a4138bd2dfa6897b24b85; ModelName: R0805_L2.0-W1.3-H0.6; ModelTransform: 78.74,51.181,0,0,0,0,0,-0.0005,0; Tolerance: ±0.1%; Power(Watts): 125mW; Overload Voltage (Max): 150V; Symbol: RT0805BRD071KL; Device: RT0805BRD071KL; LCSC Part Name: 薄膜电阻 1kΩ ±0.1% 125mW; SupplierPart: C110774; ManufacturerPart: RT0805BRD071KL; Supplier Footprint: 0805; JLCPCB Part Class: 扩展库; Datasheet: https://atta.szlcsc.com/upload/public/pdf/source/20171026/C133380_15089840010201058857.pdf; Supplier: LCSC; ConvertToPcb: yes; FootprintName: R0805; Type: 薄膜电阻; Value: 1kΩ; Temperature Coefficient: ±25ppm/℃; Operating Temperature Range: -55℃~+155℃
SW1 SW2 = GT-TC029B-H020-L1N: 电路结构:单刀单掷;按钮形状:圆形按钮;作用力:2.5N;安装方式:立贴;开关长度:3.9mm;开关宽度:2.9mm;开关高度:2mm;带支架:不带;触点电流:50mA;额定电压(DC):12V;绝缘电阻:100MΩ;带灯:无;机械寿命:10万次;; Manufacturer: G-Switch(品赞); AddInBom: yes; ModelId: 66818a77abbd4234b174368dfd85efdb; ModelName: SW-SMD_L3.9-W2.9-H2-P4.15-LS5.0; ModelTransform: 196.85,114.173,0,0,0,0,0,0,0; Circuit: 单刀单掷; Actuator Style: 圆形按钮; Operating Force: 2.5N; Switch Length: 3.9mm; Switch Width: 2.9mm; Switch Height: 2mm; Strike Gundam: 不带; Contact Current: 50mA; Voltage Rating (DC): 12V; Insulation Resistance: 100MΩ; Actuator/Cap Color: 黑色; With Lamp: 无; Pin Style: SMD接片; Mechanical Life: 10万次; Device: GT-TC029B-H020-L1N; Symbol: GT-TC029B-H020-L1N; LCSC Part Name: 3.9*2.9*2mm 立贴 轻触开关; SupplierPart: C843665; ManufacturerPart: GT-TC029B-H020-L1N; Supplier Footprint: SMD; JLCPCB Part Class: Extended Part; Datasheet: https://atta.szlcsc.com/upload/public/pdf/source/20231124/F8327E72251744D4A6AAF7192EF342CB.pdf; Supplier: LCSC; ConvertToPcb: yes; FootprintName: SW-SMD_L3.9-W2.9-P4.15-LS5.0; Mounting Style: 立贴; Operating Temperature: -30℃~+85℃
T1-T3 = M2_M3: Contributor: wowlkh; ConvertToPcb: yes; Origin Footprint: M3X16+6_L; Device: M2_M3; Symbol: M2_M3; spicePre: T; spiceSymbolName: M2_M3; FootprintName: M3X16+6_L; AddInBom: yes
U2 = STM32F407ZGT6: CPU内核:ARM-M4;CPU最大主频:168MHz;应用领域:-;; Manufacturer: ST(意法半导体); Symbol: STM32F407ZGT6U; AddInBom: yes; ModelId: 4b55735481674d0c808bacd550892b80; ModelTransform: 866.14,866.14,0,0,0,0,0,0,0; CPU Core: ARM-M4; CPU Maximum Speed: 168MHz; Program Storage Size: 1MB; Program Memory Type: FLASH; Number of I/O: 114; ADC (Bit): 12bit; Voltage - Supply: 1.8V~3.6V; Device: STM32F407ZGT6; LCSC Part Name: 带DSP和FPU的高性能基础系列ARM Cortex-M4 MCU，具有1 MB Flash、168 MHz CPU、ART加速器、以太网和FSMC; SupplierPart: C19156; ManufacturerPart: STM32F407ZGT6; Supplier Footprint: LQFP-144(20x20); JLCPCB Part Class: 扩展库; Datasheet: https://atta.szlcsc.com/upload/public/pdf/source/20140801/1457707197138.pdf; Supplier: LCSC; ConvertToPcb: yes; FootprintName: LQFP-144_L20.0-W20.0-P0.50-LS22.0-BL; ModelName: LQFP-144_L20.0-W20.0-P0.50-LS22.0-BL; DAC (Bit): 12bit; Applications: -
U5 U9 U11 = LZ220UF50V90RV0125: 容值:220uF;精度:±20%;额定电压:50V;纹波电流:500mA@120Hz;等效串联电阻:-;; Manufacturer: KNSCHA(科尼盛); AddInBom: yes; ModelId: b23815befd5e4172abc55cc8ac2654de; ModelTransform: 456.692,405.511,0,180,0,0,0,0,0; Tolerance: ±20%; Rated Voltage: 50V; φD: 10mm; L: 10.5mm; Lifetime @ Temp: 2000hrs@105℃; Symbol: LZ220UF50V90RV0125; Device: LZ220UF50V90RV0125; LCSC Part Name: 220uF ±20% 50V; SupplierPart: C3148157; ManufacturerPart: LZ220UF50V90RV0125; Supplier Footprint: SMD,D10xL10.5mm; JLCPCB Part Class: 扩展库; Datasheet: https://atta.szlcsc.com/upload/public/pdf/source/20220627/4AC3F111BD695FC47C296279E1E4E8A6.pdf; Supplier: LCSC; ConvertToPcb: yes; FootprintName: CAP-SMD_BD10.0-L10.3-W10.3-FD; ModelName: CAP-SMD_BD10.0-L10.3-W10.3-FD; Value: 220uF; Ripple Current: 500mA@120Hz; Equivalent Series Resistance(ESR): -; Operating Temperature: -55℃~+105℃
U6 = LM2596SX-5.0/NOPB: 功能类型:降压型;输出类型:固定;输入电压:4.5V~40V;输出电压:5V;输出电流:3A;; Manufacturer: TI(德州仪器); AddInBom: yes; ModelId: 4e421a816a7f4d57b8710832ddea550a; ModelName: TO-263-5-5P_L10.2-W8.7-H4.5-LS14.4-P1.70; ModelTransform: 401.574,560.17797,0,270,0,0,62.156,-0.08,0; Function: 降压型; Output Type: 固定; Output Voltage: 5V; Output Current: 3A; Switching Frequency: 150kHz; Synchronous Rectification: 否; Number of Outputs: 1; Topology: 降压式; Quiescent Current (Iq): 80uA; Switch tube (built-in/external): 内置; Symbol: LM2596SX-5.0/NOPB; Device: LM2596SX-5.0/NOPB; LCSC Part Name: LM2596 SIMPLE SWITCHER® 3A 降压电压调节器; SupplierPart: C10002; ManufacturerPart: LM2596SX-5.0/NOPB; Supplier Footprint: TO-263-5; JLCPCB Part Class: 扩展库; Datasheet: https://www.ti.com/cn/lit/gpn/lm2596; Supplier: LCSC; ConvertToPcb: yes; FootprintName: TO-263-5_L10.2-W8.9-P1.70-TL; Input Voltage: 4.5V~40V; Operating Temperature: -40℃~+125℃
U8 U10 = LM2596SX-ADJ/NOPB: 功能类型:降压型;输出类型:可调;输入电压:4.5V~40V;输出电压:1.2V~37V;输出电流:3A;; Manufacturer: TI(德州仪器); AddInBom: yes; ModelId: 4e421a816a7f4d57b8710832ddea550a; ModelName: TO-263-5-5P_L10.2-W8.7-H4.5-LS14.4-P1.70; ModelTransform: 401.574,560.17797,0,270,0,0,62.156,-0.08,0; Function: 降压型; Output Type: 可调; Output Current: 3A; Switching Frequency: 150kHz; Synchronous Rectification: 否; Number of Outputs: 1; Topology: 降压式; Quiescent Current (Iq): 80uA; Switch tube (built-in/external): 内置; Symbol: LM2596SX-ADJ/NOPB; Device: LM2596SX-ADJ/NOPB; LCSC Part Name: LM2596 SIMPLE SWITCHER® 3A 降压稳压器; SupplierPart: C29781; ManufacturerPart: LM2596SX-ADJ/NOPB; Supplier Footprint: TO-263-5; JLCPCB Part Class: 扩展库; Datasheet: https://www.ti.com/cn/lit/gpn/lm2596; Supplier: LCSC; ConvertToPcb: yes; FootprintName: TO-263-5_L10.2-W8.9-P1.70-TL; Input Voltage: 4.5V~40V; Output Voltage: 1.2V~37V; Operating Temperature: -40℃~+125℃
X1 = Q13FC13500004_C32346: 晶振类型:贴片晶振;频率:32.768kHz;常温频差:±20ppm;负载电容:12.5pF;; Manufacturer: EPSON(爱普生); Symbol: Q13FC1350000400; AddInBom: yes; ModelId: 751105e878f044059ef0ee72de95f96e; ModelTransform: 125.984,59.055,0,0,0,0,0,0,0; Crystal Type: 贴片晶振; Normal temperature Frequency Tolerance: ±20ppm; Load Capacitor: 12.5pF; Equivalent Series Resistance (ESR): 70kΩ; Device: Q13FC13500004_C32346; LCSC Part Name: 32.768kHz ±20ppm 12.5pF; SupplierPart: C32346; ManufacturerPart: Q13FC13500004; Supplier Footprint: SMD3215-2P; JLCPCB Part Class: Basic Part; Datasheet: https://atta.szlcsc.com/upload/public/pdf/source/20240418/0E0FF5F0356BA3753F616001439D1416.pdf; Supplier: LCSC; ConvertToPcb: yes; FootprintName: FC-135R_L3.2-W1.5; ModelName: FC-135R_L3.2-W1.5; Value: 32.768kHz; Operating Temperature: -40℃~+85℃
X3 = X32258MSB4SI: 晶振类型:贴片晶振;频率:8MHz;常温频差:±10ppm;负载电容:20pF;频率稳定度:±20ppm;; Manufacturer: YXC(扬兴晶振); AddInBom: yes; ModelId: 02485e56ba8d4732a26526d2983fc729; ModelTransform: 125.984,98.425,0,0,0,0,0,0,0; Normal temperature Frequency Tolerance: ±10ppm; Load Capacitance: 20pF; Frequency Stability: ±20ppm; Equivalent Series Resistance(ESR): 120Ω; Symbol: X32258MSB4SI; Device: X32258MSB4SI; LCSC Part Name: YSX321SL 8MHZ 4P 3225 20PF ±10PPM -40~85℃ (±20PPM); SupplierPart: C2682774; ManufacturerPart: X32258MSB4SI; Supplier Footprint: SMD3225-4P; JLCPCB Part Class: 扩展库; Datasheet: https://item.szlcsc.com/datasheet/X32258MSB4SI/2777871.html; Supplier: LCSC; ConvertToPcb: yes; FootprintName: CRYSTAL-SMD_4P-L3.2-W2.5-BL; ModelName: CRYSTAL-SMD_4P-L3.2-W2.5-BL; Type: 贴片晶振; Value: 8MHz; Operating Temperature: -40℃~+85℃